# Altium schematic sheet Button.schdoc
size 49 x 35 mm
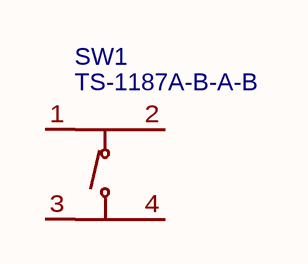
[diagram p0: Button.schdoc]

## Parts
SW1  TS-1187A-B-A-B  [SW-SMD_4P-L5.1-W5.1-P3.70-LS6.5-TL-2]

## Nets

Not connected (* = marked no-connect by the designer): SW1 1(A) 2(B) 3(C) 4(D)

## Library data of the parts
SW1 = TS-1187A-B-A-B: BOM_Manufacturer: XKB Enterprise; Contributor: LCSC; BOM_Supplier: LCSC; BOM_Supplier Part: C318884; BOM_Manufacturer Part: TS-1187A-B-A-B; BOM_JLCPCB Part Class: Extended Part; spicePre: S; spiceSymbolName: TS-1187A-B-A-B